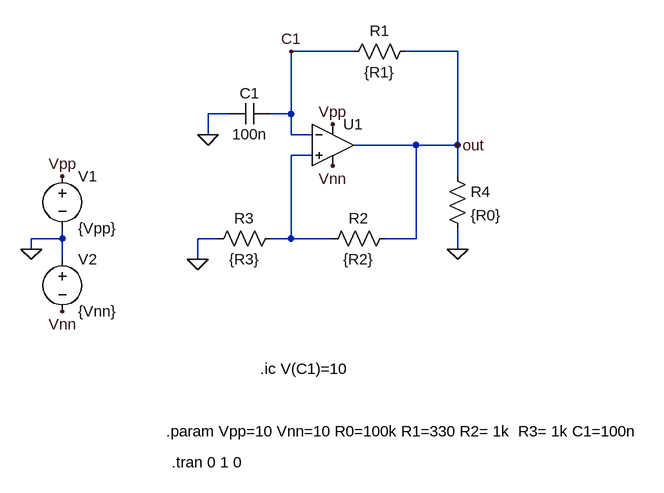
[diagram p0: schematic lab15.asc]
lab15.asc, the LTspice schematic file:
Version 4
SHEET 1 988 680
WIRE -192 -96 -288 -96
WIRE -32 -96 -112 -96
WIRE -384 0 -416 0
WIRE -288 0 -288 -96
WIRE -288 0 -320 0
WIRE -416 32 -416 0
WIRE -288 32 -288 0
WIRE -256 32 -288 32
WIRE -96 48 -192 48
WIRE -32 48 -32 -96
WIRE -32 48 -96 48
WIRE -256 64 -288 64
WIRE -32 96 -32 48
WIRE -640 192 -640 176
WIRE -640 192 -688 192
WIRE -400 192 -432 192
WIRE -288 192 -288 64
WIRE -288 192 -320 192
WIRE -224 192 -288 192
WIRE -96 192 -96 48
WIRE -96 192 -144 192
WIRE -688 208 -688 192
WIRE -32 208 -32 176
WIRE -640 224 -640 192
WIRE -432 224 -432 192
FLAG -688 208 0
FLAG -640 96 Vpp
FLAG -640 304 Vnn
FLAG -32 48 out
FLAG -32 208 0
FLAG -416 32 0
FLAG -432 224 0
FLAG -224 16 Vpp
FLAG -224 80 Vnn
FLAG -288 -96 C1
SYMBOL voltage -640 80 R0
SYMATTR InstName V1
SYMATTR Value {Vpp}
SYMBOL voltage -640 208 R0
SYMATTR InstName V2
SYMATTR Value {Vnn}
SYMBOL res -96 -112 R90
WINDOW 0 0 56 VBottom 2
WINDOW 3 32 56 VTop 2
SYMATTR InstName R1
SYMATTR Value {R1}
SYMBOL cap -320 -16 R90
WINDOW 0 0 32 VBottom 2
WINDOW 3 32 32 VTop 2
SYMATTR InstName C1
SYMATTR Value 100n
SYMATTR SpiceLine V=25 Irms=0 Rser=0 Lser=0
SYMBOL res -128 176 R90
WINDOW 0 0 56 VBottom 2
WINDOW 3 32 56 VTop 2
SYMATTR InstName R2
SYMATTR Value {R2}
SYMBOL res -304 176 R90
WINDOW 0 0 56 VBottom 2
WINDOW 3 32 56 VTop 2
SYMATTR InstName R3
SYMATTR Value {R3}
SYMBOL Opamps\\UniversalOpamp2 -224 48 R0
SYMATTR InstName U1
SYMBOL res -48 80 R0
SYMATTR InstName R4
SYMATTR Value {R0}
TEXT -480 488 Left 2 !.param Vpp=10 Vnn=10 R0=100k R1=330 R2= 1k  R3= 1k C1=100n
TEXT -472 536 Left 2 !.tran 0 1 0
TEXT -336 392 Left 2 !.ic V(C1)=10

The netlist it stands for:
* lab15.asc
V1 Vpp 0 {Vpp}
V2 0 Vnn {Vnn}
R1 out C1 {R1}
C1 C1 0 100n V=25 Irms=0 Rser=0 Lser=0
R2 out N001 {R2}
R3 N001 0 {R3}
XU1 N001 C1 Vpp Vnn out level.2 Avol=1Meg GBW=10Meg Slew=10Meg ilimit=25m rail=0 Vos=0 phimargin=45 en=0 enk=0 in=0 ink=0 Rin=500Meg  ; pins IN+ IN- V+ V- OUT
R4 out 0 {R0}
.param Vpp=10 Vnn=10 R0=100k R1=330 R2= 1k  R3= 1k C1=100n
.tran 0 1 0
.ic V(C1)=10
.lib UniversalOpamps2.sub
.backanno
.end